# EasyEDA Pro project TC358870 HDMI2MIPI.epro, schematic Schematic4
Board Name: Board1; Create Date: 2025-08-10; Page Name: P1; Project Name: tc358870 HDMI转MIPI; Schematic Name: Schematic4; Update Date: 2025-08-10; Company: 嘉立创EDA; Page Size: A3; Version: V1.0
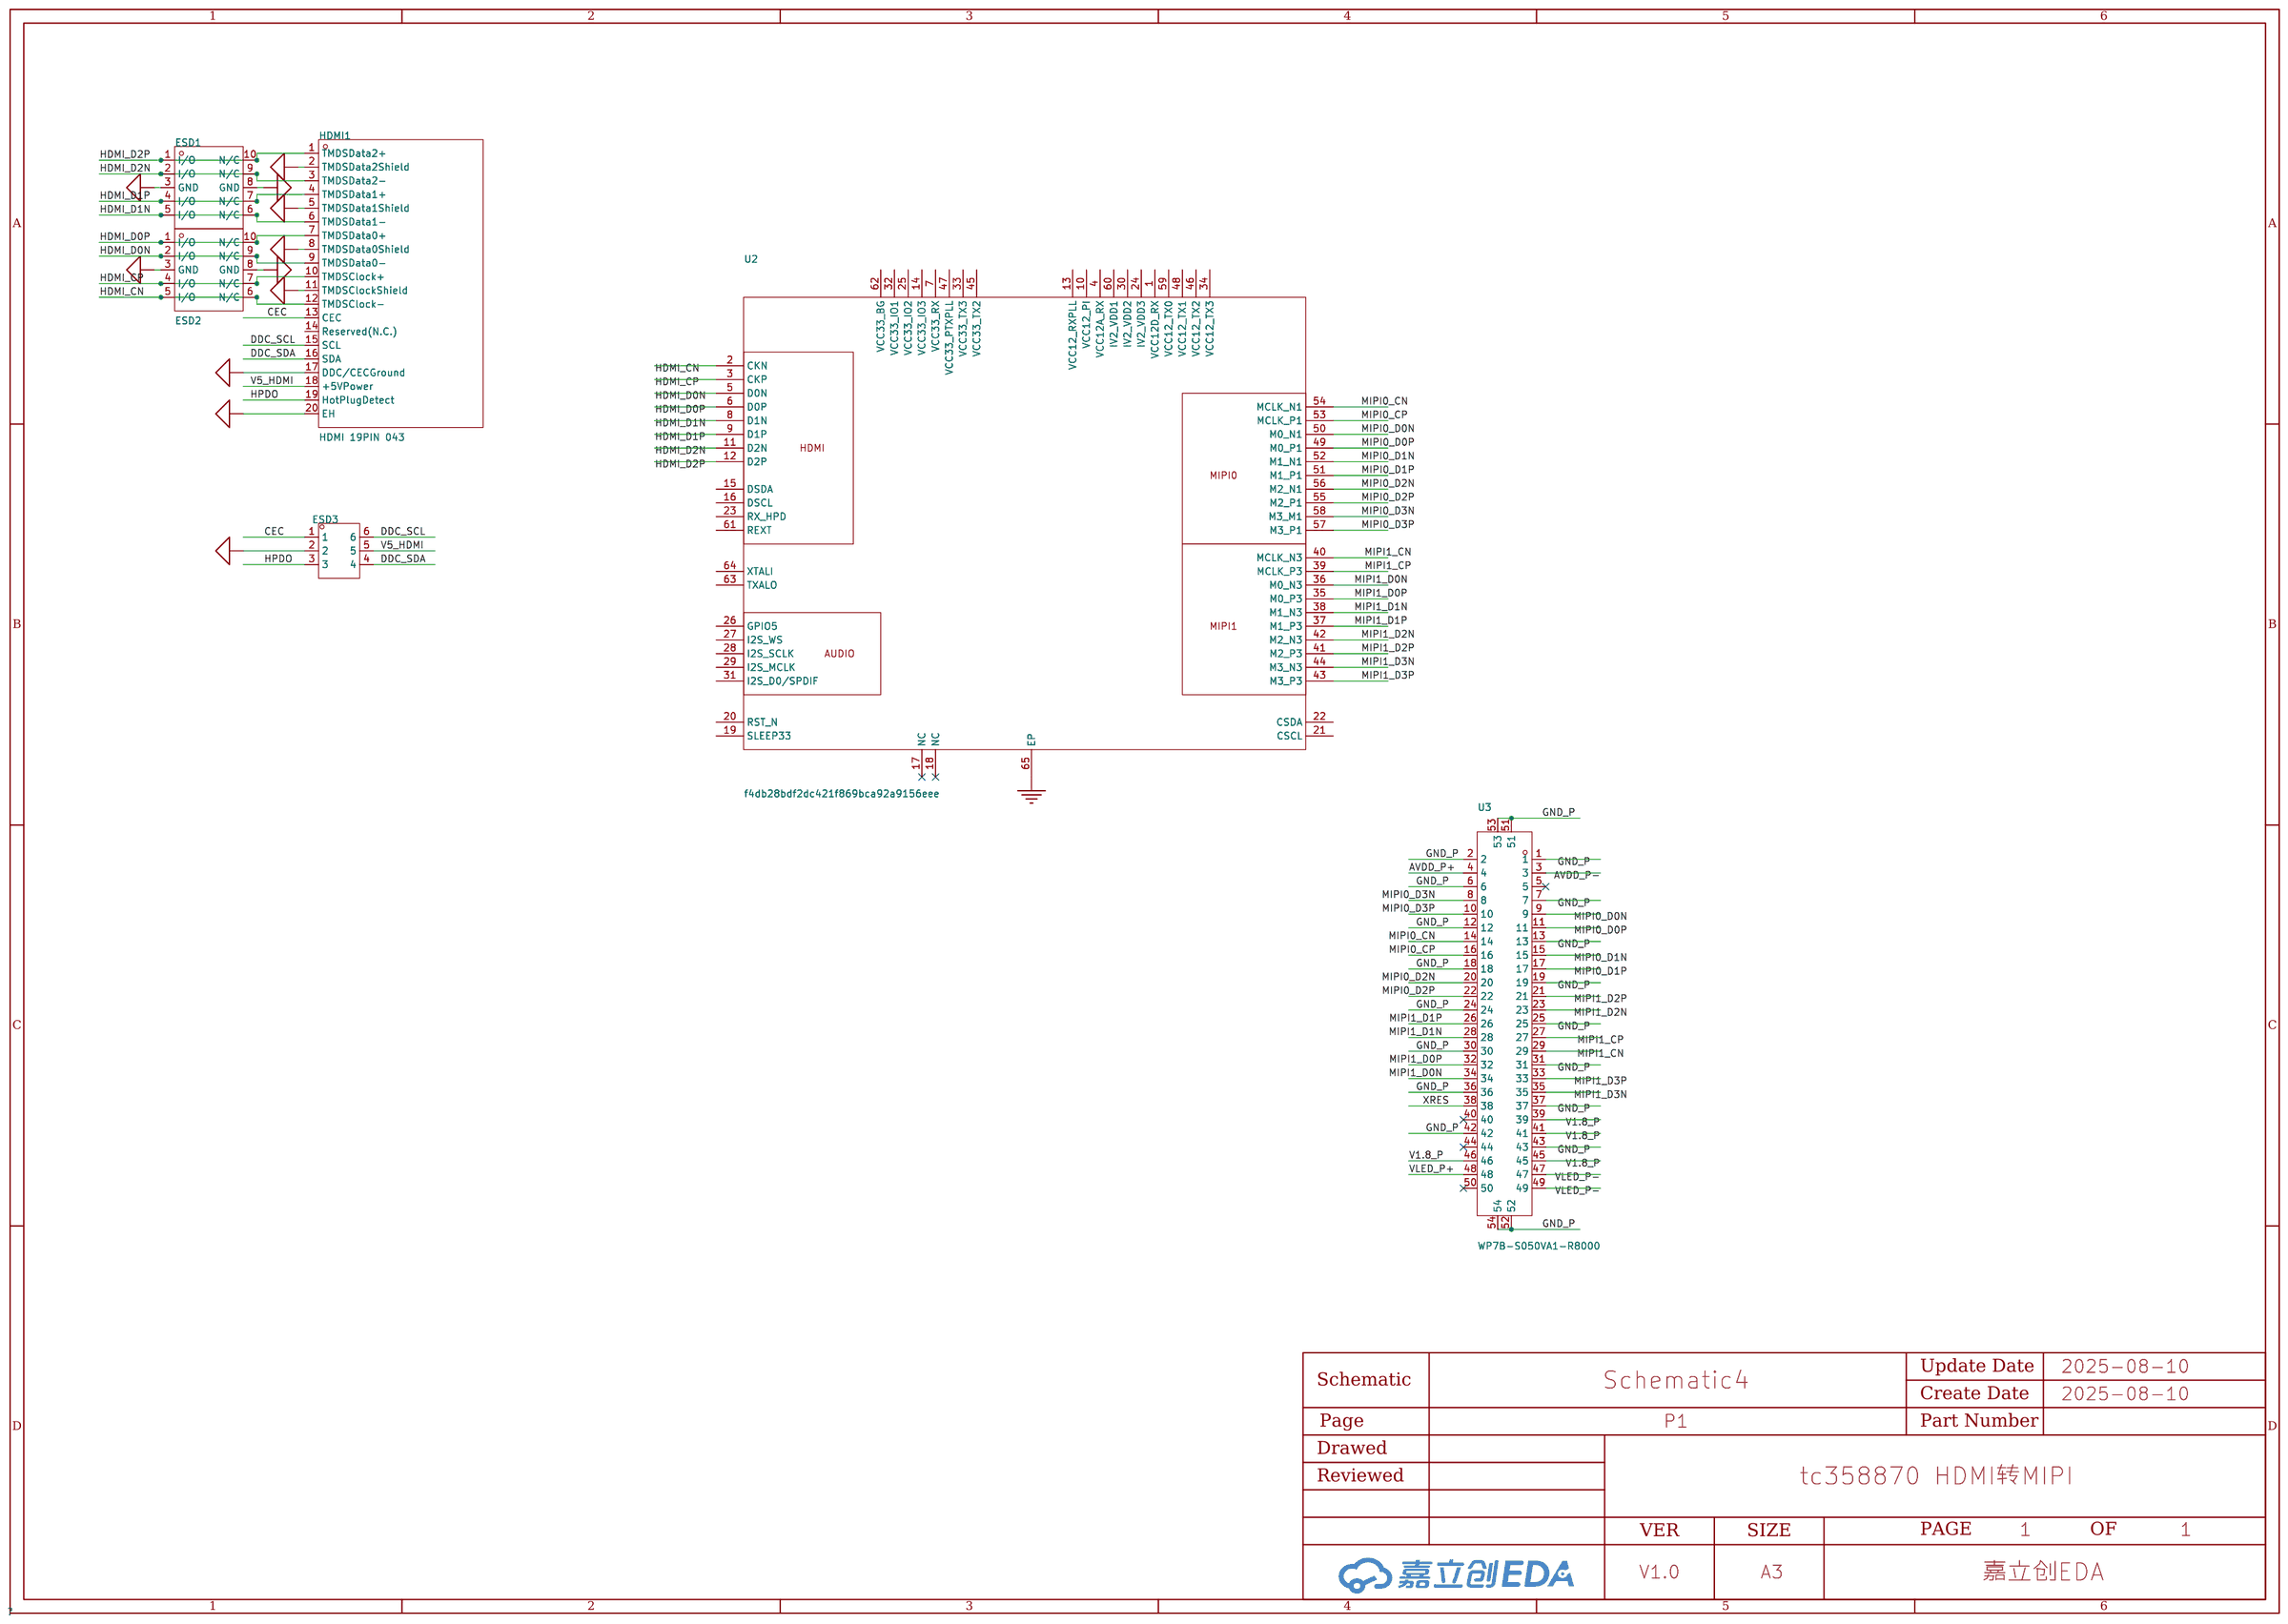
[diagram p5: schematic sheet]

## Parts
ESD1  ESD7004MUTAG  [UDFN-10_L2.5-W1.0-P0.50-BL]
ESD2  ESD7004MUTAG  [UDFN-10_L2.5-W1.0-P0.50-BL]
ESD3  NUP4114HMR6T1G  [SOT-23-6_L2.9-W1.6-P0.95-LS2.8-BR]
HDMI1  HDMI 19PIN 043  [HDMI-SMD_HDMI-19PIN-043]
U2  f4db28bdf2dc421f869bca92a9156eee  [QFN-64_L7.5-W7.5-P0.40-TL-EP6.2]
U3  WP7B-S050VA1-R8000  [CONN-SMD_WP7B-S050VA1-R8000]

## Library data of the parts
ESD1 ESD2 = ESD7004MUTAG: 反向截止电压(Vrwm):5V;击穿电压(VBR):5.5V;峰值脉冲电流(Ipp)@8/20us:1A@(8/20us);钳位电压(Vc)@Ipp:10V;峰值脉冲功率(Ppp)@8/20us:-;结电容(Cj)@1MHz:0.4pF@1MHz;工作温度:-55℃~+125℃@(Tj);; LCSC Part Name: ESD Protection Diode with Low Capacitance; Supplier Part: C1972960; Manufacturer: onsemi(安森美); Supplier Footprint: UDFN-10(1x2.5); JLCPCB Part Class: 扩展库; Datasheet: https://atta.szlcsc.com/upload/public/pdf/source/20201127/C294530_C0006EA10DA7174AECD43404D82BADC3.pdf; Supplier: LCSC; Reverse Stand-Off Voltage (Vrwm): 5V; Breakdown Voltage (VBR): 5.5V; Peak Pulse Current(Ipp)@8/20us: 1A@(8/20us); Clamping Voltage@Ipp: 10V; Junction Capacitance(Cj)@1MHz: 0.4pF@1MHz; Operating Temperature: -55℃~+125℃@(Tj)
ESD3 = NUP4114HMR6T1G: Supplier Part: C260431; Manufacturer: onsemi(安森美); Supplier Footprint: SOT-23-6; JLCPCB Part Class: 扩展库; Datasheet: https://atta.szlcsc.com/upload/public/pdf/source/20180801/C260431_50B6EE707D505754417F87B3D09AAF49.pdf; Supplier: LCSC
HDMI1 = HDMI 19PIN 043: 连接器类型:HDMI;公母:母;总PIN位数:19P;安装方式:卧贴;排数:-;额定电流:300mA;工作温度范围:-55℃~+85℃;; LCSC Part Name: HDMI 母 P数:19P; Supplier Part: C2858275; Manufacturer: SHOU HAN(首韩); Supplier Footprint: SMD; JLCPCB Part Class: 扩展库; Datasheet: https://atta.szlcsc.com/upload/public/pdf/source/20210728/C2858275_DF299413048A9CF092C2A61AB97004F4.pdf; Supplier: LCSC; Connector Type: HDMI; Gender: 母; Number of Pins: 19P; Mounting Style: 卧贴; Current Rating (Max): 300mA; Operating Temperature Range: -55℃~+85℃
U2 = LT6911C: HDMI1.4/DP++到双端口MIPI DSI/CSI/LVDS带音频
U3 = WP7B-S050VA1-R8000_1: PIN总数:-;间距:0.4mm;安装方式:立贴;行数:2;; LCSC Part Name: 间距:0.4mm 母 立贴; Supplier Part: C3652895; Manufacturer: JAE(日本航空电子); Supplier Footprint: SMD,P=0.4mm; JLCPCB Part Class: 扩展库; Supplier: LCSC; Pitch: 0.4mm; Mounting Style: 立贴; Number of Rows: 2; Contact Plating: 金

## Nets
AVDD_P+: U3.4
AVDD_P-: U3.3
GND: U2.65(EP)
GND_P: U3.1 U3.2 U3.6 U3.7 U3.12 U3.13 U3.18 U3.19 U3.24 U3.25 U3.30 U3.31 U3.36 U3.37 U3.42 U3.43 U3.51 U3.52 U3.53 U3.54
GND_TMDS: ESD1.3(GND) ESD1.8(GND) ESD2.3(GND) ESD2.8(GND) ESD3.2 HDMI1.2(TMDSData2Shield) HDMI1.5(TMDSData1Shield) HDMI1.8(TMDSData0Shield) HDMI1.11(TMDSClockShield) HDMI1.17(DDC/CECGround) HDMI1.20(EH)
V1.8_P: U3.39 U3.41 U3.45 U3.46
V5_HDMI: ESD3.5 HDMI1.18(+5VPower)
CEC: ESD3.1 HDMI1.13(CEC)
DDC_SCL: ESD3.6 HDMI1.15(SCL)
DDC_SDA: ESD3.4 HDMI1.16(SDA)
HDMI_CN: ESD2.5(I/O) ESD2.6(N/C) HDMI1.12(TMDSClock-) U2.2(CKN)
HDMI_CP: ESD2.4(I/O) ESD2.7(N/C) HDMI1.10(TMDSClock+) U2.3(CKP)
HDMI_D0N: ESD2.2(I/O) ESD2.9(N/C) HDMI1.9(TMDSData0-) U2.5(D0N)
HDMI_D0P: ESD2.1(I/O) ESD2.10(N/C) HDMI1.7(TMDSData0+) U2.6(D0P)
HDMI_D1N: ESD1.5(I/O) ESD1.6(N/C) HDMI1.6(TMDSData1-) U2.8(D1N)
HDMI_D1P: ESD1.4(I/O) ESD1.7(N/C) HDMI1.4(TMDSData1+) U2.9(D1P)
HDMI_D2N: ESD1.2(I/O) ESD1.9(N/C) HDMI1.3(TMDSData2-) U2.11(D2N)
HDMI_D2P: ESD1.1(I/O) ESD1.10(N/C) HDMI1.1(TMDSData2+) U2.12(D2P)
HPDO: ESD3.3 HDMI1.19(HotPlugDetect)
MIPI0_CN: U2.54(MCLK_N1) U3.14
MIPI0_CP: U2.53(MCLK_P1) U3.16
MIPI0_D0N: U2.50(M0_N1) U3.9
MIPI0_D0P: U2.49(M0_P1) U3.11
MIPI0_D1N: U2.52(M1_N1) U3.15
MIPI0_D1P: U2.51(M1_P1) U3.17
MIPI0_D2N: U2.56(M2_N1) U3.20
MIPI0_D2P: U2.55(M2_P1) U3.22
MIPI0_D3N: U2.58(M3_M1) U3.8
MIPI0_D3P: U2.57(M3_P1) U3.10
MIPI1_CN: U2.40(MCLK_N3) U3.29
MIPI1_CP: U2.39(MCLK_P3) U3.27
MIPI1_D0N: U2.36(M0_N3) U3.34
MIPI1_D0P: U2.35(M0_P3) U3.32
MIPI1_D1N: U2.38(M1_N3) U3.28
MIPI1_D1P: U2.37(M1_P3) U3.26
MIPI1_D2N: U2.42(M2_N3) U3.23
MIPI1_D2P: U2.41(M2_P3) U3.21
MIPI1_D3N: U2.44(M3_N3) U3.35
MIPI1_D3P: U2.43(M3_P3) U3.33
VLED_P+: U3.48
VLED_P-: U3.47 U3.49
XRES: U3.38

Not connected (* = marked no-connect by the designer): HDMI1 14(Reserved(N.C.)); U2 1(VCC12D_RX) 4(VCC12A_RX) 7(VCC33_RX) 10(VCC12_PI) 13(VCC12_RXPLL) 14(VCC33_IO3) 15(DSDA) 16(DSCL) 17(NC)* 18(NC)* 19(SLEEP33) 20(RST_N) 21(CSCL) 22(CSDA) 23(RX_HPD) 24(IV2_VDD3) 25(VCC33_IO2) 26(GPIO5) 27(I2S_WS) 28(I2S_SCLK) 29(I2S_MCLK) 30(IV2_VDD2) 31(I2S_D0/SPDIF) 32(VCC33_IO1) 33(VCC33_TX3) 34(VCC12_TX3) 45(VCC33_TX2) 46(VCC12_TX2) 47(VCC33_PTXPLL) 48(VCC12_TX1) 59(VCC12_TX0) 60(IV2_VDD1) 61(REXT) 62(VCC33_BG) 63(TXALO) 64(XTALI); U3 5* 40* 44* 50*
